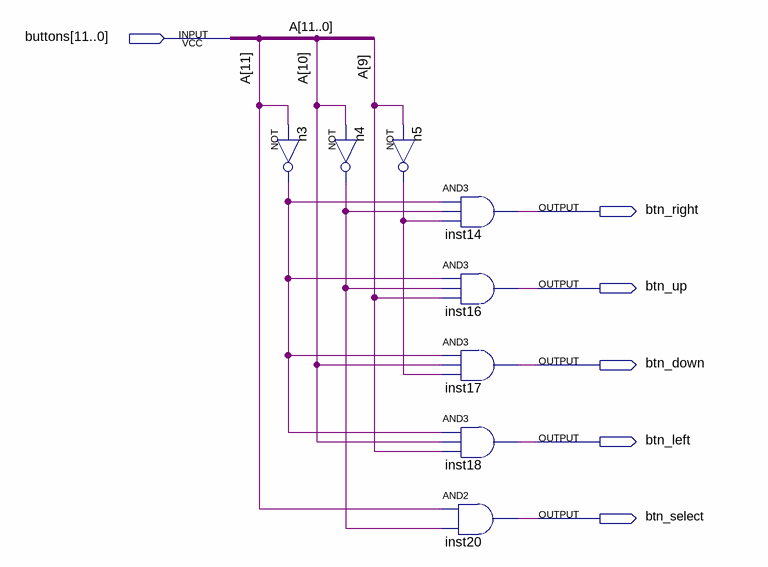
[diagram p0: schematic sheet]
// Quartus schematic buttons_adc.bdf as structural Verilog: 8 symbols, 6 pins
module buttons_adc (
  input  [11:0] buttons,
  output btn_right,
  output btn_up,
  output btn_down,
  output btn_left,
  output btn_select
);

  wire n3_out, n4_out, n5_out;

  not n3 (n3_out, buttons[11]);
  not n4 (n4_out, buttons[10]);
  not n5 (n5_out, buttons[9]);
  and inst14 (btn_right, n3_out, n4_out, n5_out);
  and inst16 (btn_up, n3_out, n4_out, buttons[9]);
  and inst17 (btn_down, n3_out, buttons[10], n5_out);
  and inst18 (btn_left, n3_out, buttons[10], buttons[9]);
  and inst20 (btn_select, buttons[11], n4_out);

  // Other names for the same wires on the sheet: A[11:0] = buttons
endmodule
